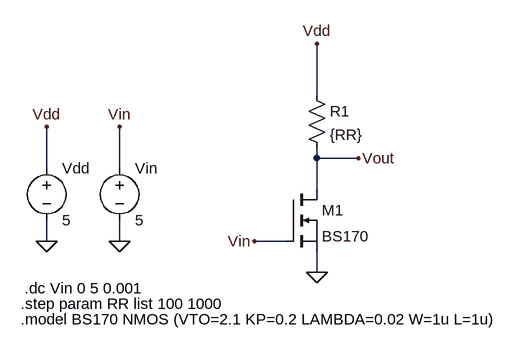
[diagram p0: schematic lab_ee_2.asc]
lab_ee_2.asc, the LTspice schematic file:
Version 4
SHEET 1 880 680
WIRE 288 -32 288 -112
WIRE 288 64 288 48
WIRE 352 64 288 64
WIRE -128 80 -128 16
WIRE -16 80 -16 16
WIRE 288 112 288 64
WIRE -128 192 -128 160
WIRE -16 192 -16 160
WIRE 240 192 192 192
WIRE 288 240 288 208
FLAG 288 240 0
FLAG -16 192 0
FLAG -128 192 0
FLAG -16 16 Vin
FLAG 192 192 Vin
FLAG -128 16 Vdd
FLAG 288 -112 Vdd
FLAG 352 64 Vout
SYMBOL voltage -16 64 R0
WINDOW 123 0 0 Left 0
WINDOW 39 0 0 Left 0
SYMATTR InstName Vin
SYMATTR Value 5
SYMBOL nmos 240 112 R0
SYMATTR InstName M1
SYMATTR Value BS170
SYMBOL res 272 -48 R0
SYMATTR InstName R1
SYMATTR Value {RR}
SYMBOL voltage -128 64 R0
WINDOW 123 0 0 Left 0
WINDOW 39 0 0 Left 0
SYMATTR InstName Vdd
SYMATTR Value 5
TEXT -162 264 Left 2 !.dc Vin 0 5 0.001
TEXT -168 288 Left 2 !.step param RR list 100 1000
TEXT -168 312 Left 2 !.model BS170 NMOS (VTO=2.1 KP=0.2 LAMBDA=0.02 W=1u L=1u)

The netlist it stands for:
* lab_ee_2.asc
Vin Vin 0 5
M1 Vout Vin 0 0 BS170
R1 Vdd Vout {RR}
Vdd Vdd 0 5
.model NMOS NMOS
.model PMOS PMOS
.lib standard.mos
.dc Vin 0 5 0.001
.step param RR list 100 1000
.model BS170 NMOS (VTO=2.1 KP=0.2 LAMBDA=0.02 W=1u L=1u)
.backanno
.end